# EAGLE design peripheral2 (EAGLE 7.6.0)
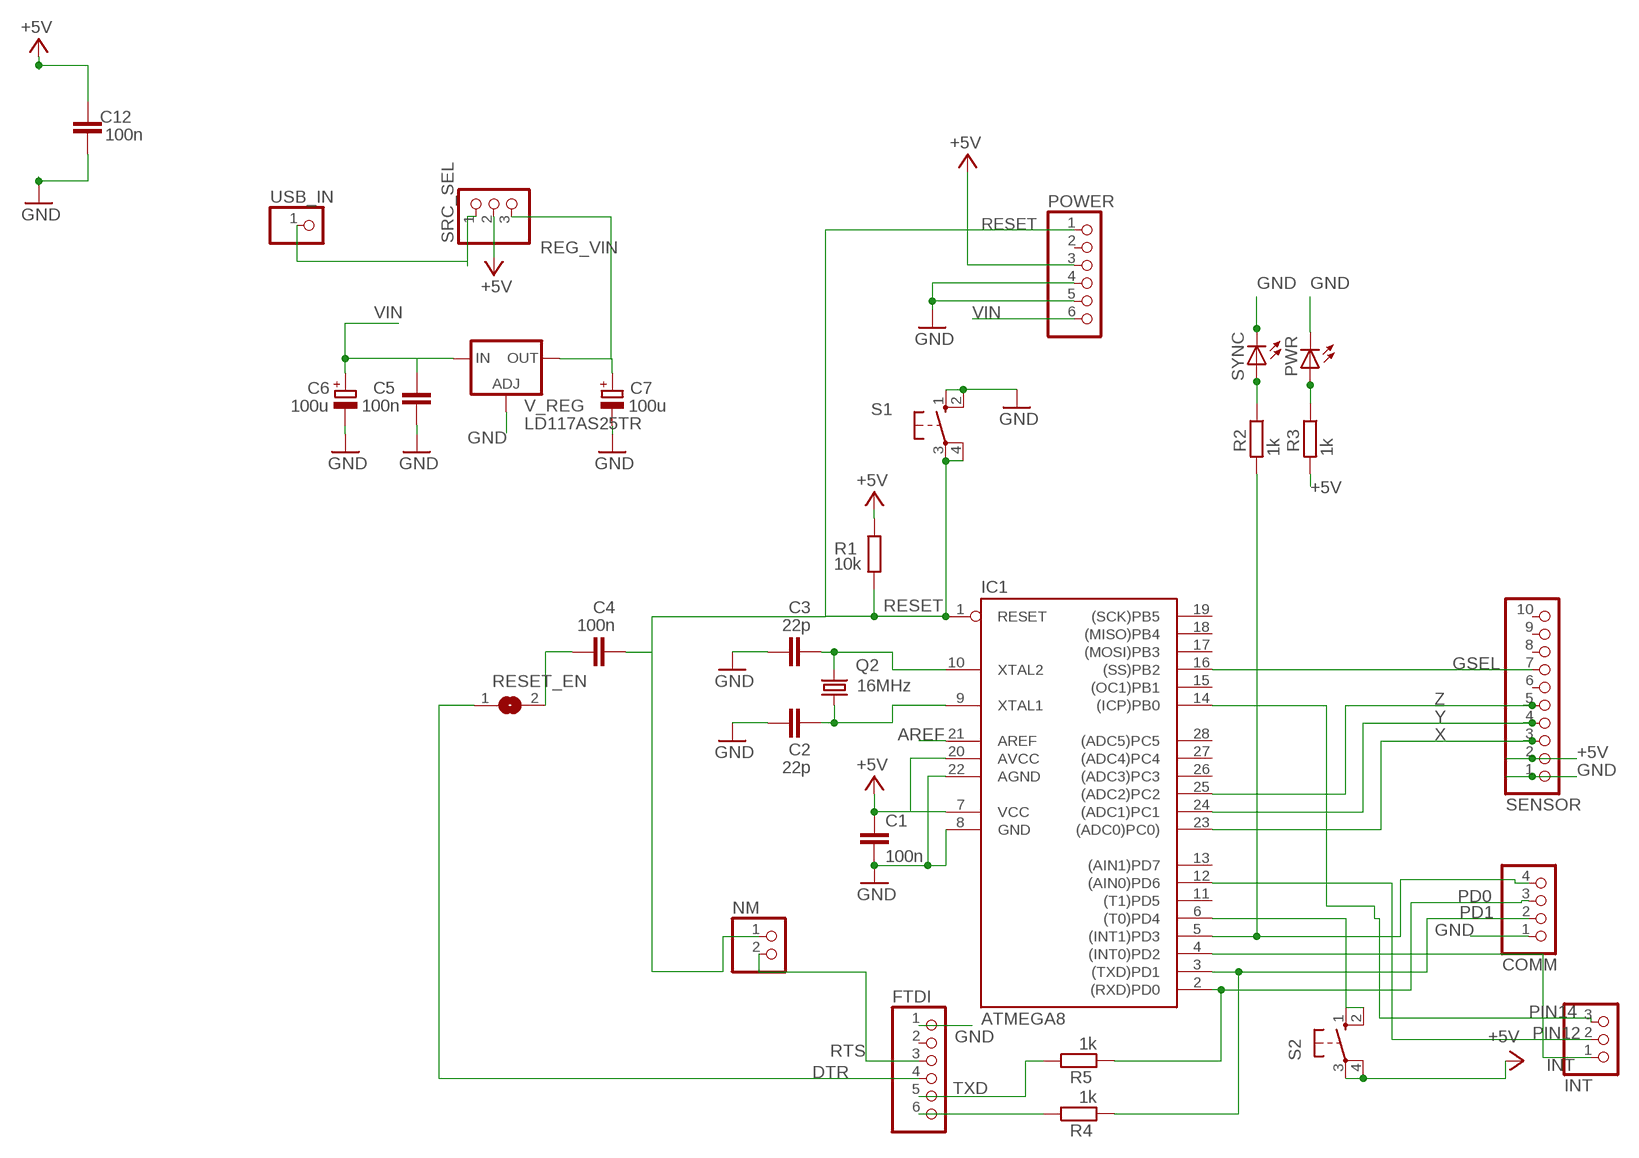
[diagram p0: schematic, sheet 1]

## Parts
C1  100n  C-EUC1206  [C1206]
C2  22p  C-EUC1206  [C1206]
C3  22p  C-EUC1206  [C1206]
C4  100n  C-EUC1206  [C1206]
C5  100n  C-EUC1206  [C1206]
C6  100u  CPOL-EUD  [PANASONIC_D]
C7  100u  CPOL-EUD  [PANASONIC_D]
C12  100n  C-EUC1206  [C1206]
COMM  PINHD-1X4  [1X04]
FTDI  PINHD-1X6  [1X06]
IC1  ATMEGA8  AT90S4433P  [DIL28-3]
INT  PINHD-1X3  [1X03]
NM  PINHD-1X2  [1X02]
POWER  PINHD-1X6  [1X06]
PWR  LEDCHIPLED_1206  [CHIPLED_1206]
Q2  16MHz  CRYTALHC49S  [HC49/S]
R1  10k  R-EU_R1206  [R1206]
R2  1k  R-EU_R1206  [R1206]
R3  1k  R-EU_R1206  [R1206]
R4  1k  R-EU_R1206  [R1206]
R5  1k  R-EU_R1206  [R1206]
RESET_EN  SJ  [SJ]
S1  10-XX  [B3F-10XX]
S2  10-XX  [B3F-10XX]
SENSOR  PINHD-1X10  [1X10]
SRC_SEL  PINHD-1X3  [1X03]
SYNC  LEDCHIPLED_1206  [CHIPLED_1206]
USB_IN  PINHD-1X1  [1X01]
V_REG  LD117AS25TR  [SOT223]

## Nets
+5V [usbvcc]: C1.1 C12.2 IC1.7(VCC) IC1.20(AVCC) POWER.3 R1.2 R3.2 S2.3(P) S2.4(P1) SENSOR.2 SRC_SEL.2
A3: COMM.4 IC1.5((INT1)PD3) R2.2
AREF [aref]: IC1.21(AREF)
DTR: FTDI.4 RESET_EN.1
GND [gnd]: C1.2 C2.1 C3.1 C5.1 C6.- C7.- C12.1 COMM.1 FTDI.1 IC1.8(GND) IC1.22(AGND) POWER.4 POWER.5 PWR.C S1.1(S) S1.2(S1) SENSOR.1 SYNC.C V_REG.1(ADJ)
GSEL: IC1.16((SS)PB2) SENSOR.7
INT: IC1.4((INT0)PD2) INT.1
N$1: R2.1 SYNC.A
N$2: PWR.A R3.1
N$5: FTDI.6 R4.1
N$6: C2.2 IC1.9(XTAL1) Q2.1
N$7: C3.2 IC1.10(XTAL2) Q2.2
N$10: IC1.6((T0)PD4) S2.1(S) S2.2(S1)
N$11: C4.1 RESET_EN.2
PD0: COMM.3 IC1.2((RXD)PD0) R5.2
PD1: COMM.2 IC1.3((TXD)PD1) R4.2
PIN12: IC1.12((AIN0)PD6) INT.2
PIN14: IC1.14((ICP)PB0) INT.3
REG_VIN [usbvcc]: C7.+ SRC_SEL.3 V_REG.4(OUT)
RESET: C4.2 IC1.1(RESET) NM.1 POWER.1 R1.1 S1.3(P) S1.4(P1)
RTS: FTDI.3 NM.2
TXD: FTDI.5 R5.1
USB_VCC: SRC_SEL.1 USB_IN.1
VIN [power]: C5.2 C6.+ POWER.6 V_REG.3(IN)
X: IC1.23((ADC0)PC0)) SENSOR.3
Y: IC1.24((ADC1)PC1) SENSOR.4
Z: IC1.25((ADC2)PC2) SENSOR.5
Unconnected: FTDI.2 IC1.11((T1)PD5) IC1.13((AIN1)PD7) IC1.15((OC1)PB1) IC1.17((MOSI)PB3) IC1.18((MISO)PB4) IC1.19((SCK)PB5) IC1.26((ADC3)PC3) IC1.27((ADC4)PC4) IC1.28((ADC5)PC5) POWER.2 SENSOR.6 SENSOR.8 SENSOR.9 SENSOR.10

## Library data of the parts
C1-C5 C12 = rcl:C-EU: CAPACITOR, European symbol
C6 C7 = rcl:CPOL-EU: POLARIZED CAPACITOR, European symbol
COMM = pinhead:PINHD-1X4: PIN HEADER
FTDI POWER = pinhead:PINHD-1X6: PIN HEADER
IC1 = atmel:AT90S4433: MICROCONTROLLER 4 Kbytes FLASH 128 bytes SRAM 256 bytes EEPROM UART 6-channel 10 bit ADC
INT SRC_SEL = pinhead:PINHD-1X3: PIN HEADER
NM = pinhead:PINHD-1X2: PIN HEADER
PWR SYNC = led:LED: LED OSRAM: - CHIPLED LG R971, LG N971, LY N971, LG Q971, LY Q971, LO R971, LY R971 LH N974, LH R974 LS Q976, LO Q976, LY Q976 LO Q996 - Hyper CHIPLED LW Q18S LB Q993, LB Q99A, LB R99A - SideLED LS A670, LO A670, LY A670, LG A670, LP A670 LB A673, LV A673, LT A673, LW A673 LH A674 LY A675 LS A676, LA A676, LO A676, LY A676, LW A676 LS A679, LY A679, LG A679 - Hyper Micro SIDELED® LS Y876, LA Y876, LO Y876, LY Y876 LT Y87S - SmartLED LW L88C, LW L88S LB L89C, LB L89S, LG L890 LS L89K, LO L89K, LY L89K LS L896, LA L896, LO L896, LY L896 - TOPLED LS T670, LO T670, LY T670, LG T670, LP T670 LSG T670, LSP T670, LSY T670, LOP T670, LYG T670 LG T671, LOG T671, LSG T671 LB T673, LV T673, LT T673, LW T673 LH T674 LS T676, LA T676, LO T676, LY T676, LB T676, LH T676, LSB T676, LW T676 LB T67C, LV T67C, LT T67C, LS T67K, LO T67K, LY T67K, LW E67C LS E67B, LA E67B, LO E67B, LY E67B, LB E67C, LV E67C, LT E67C LW T67C LS T679, LY T679, LG T679 LS T770, LO T770, LY T770, LG T770, LP T770 LB T773, LV T773, LT T773, LW T773 LH T774 LS E675, LA E675, LY E675, LS T675 LS T776, LA T776, LO T776, LY T776, LB T776 LHGB T686 LT T68C, LB T68C - Hyper Mini TOPLED® LB M676 - Mini TOPLED Santana® LG M470 LS M47K, LO M47K, LY M47K Source: http://www.osram.convergy.de LUXEON: - LUMILED® LXK2-PW12-R00, LXK2-PW12-S00, LXK2-PW14-U00, LXK2-PW14-V00 LXK2-PM12-R00, LXK2-PM12-S00, LXK2-PM14-U00 LXK2-PE12-Q00, LXK2-PE12-R00, LXK2-PE12-S00, LXK2-PE14-T00, LXK2-PE14-U00 LXK2-PB12-K00, LXK2-PB12-L00, LXK2-PB12-M00, LXK2-PB14-N00, LXK2-PB14-P00, LXK2-PB14-Q00 LXK2-PR12-L00, LXK2-PR12-M00, LXK2-PR14-Q00, LXK2-PR14-R00 LXK2-PD12-Q00, LXK2-PD12-R00, LXK2-PD12-S00 LXK2-PH12-R00, LXK2-PH12-S00 LXK2-PL12-P00, LXK2-PL12-Q00, LXK2-PL12-R00 Source: www.luxeon.com KINGBRIGHT: KA-3528ASYC Source: www.kingbright.com
Q2 = crystal:CRYTAL: CRYSTAL
R1-R5 = rcl:R-EU_: RESISTOR, European symbol
RESET_EN = jumper:SJ: SMD solder JUMPER
S1 S2 = switch-omron:10-XX: OMRON SWITCH; MPN: B3F-1000; OC_FARNELL: 176432; OC_NEWARK: 36M3542
SENSOR = pinhead:PINHD-1X10: PIN HEADER
USB_IN = pinhead:PINHD-1X1: PIN HEADER
V_REG = v-reg:LD117A?*: Low drop fixed and adjustable positive voltage regulators 1 A Source: http://www.st.com/stonline/products/literature/ds/7194/ld1117axx.pdf

## Net classes
0 default: width 0.254 mm, drill 0.305 mm, clearance 0.152 mm
1 power: width 0.61 mm, drill 0.508 mm, clearance 0.152 mm
2 gnd: width 0.305 mm, drill 0.508 mm, clearance 0.152 mm
3 usbvcc: width 0.508 mm, drill 0.508 mm, clearance 0.152 mm
4 aref: width 0.406 mm

## Board
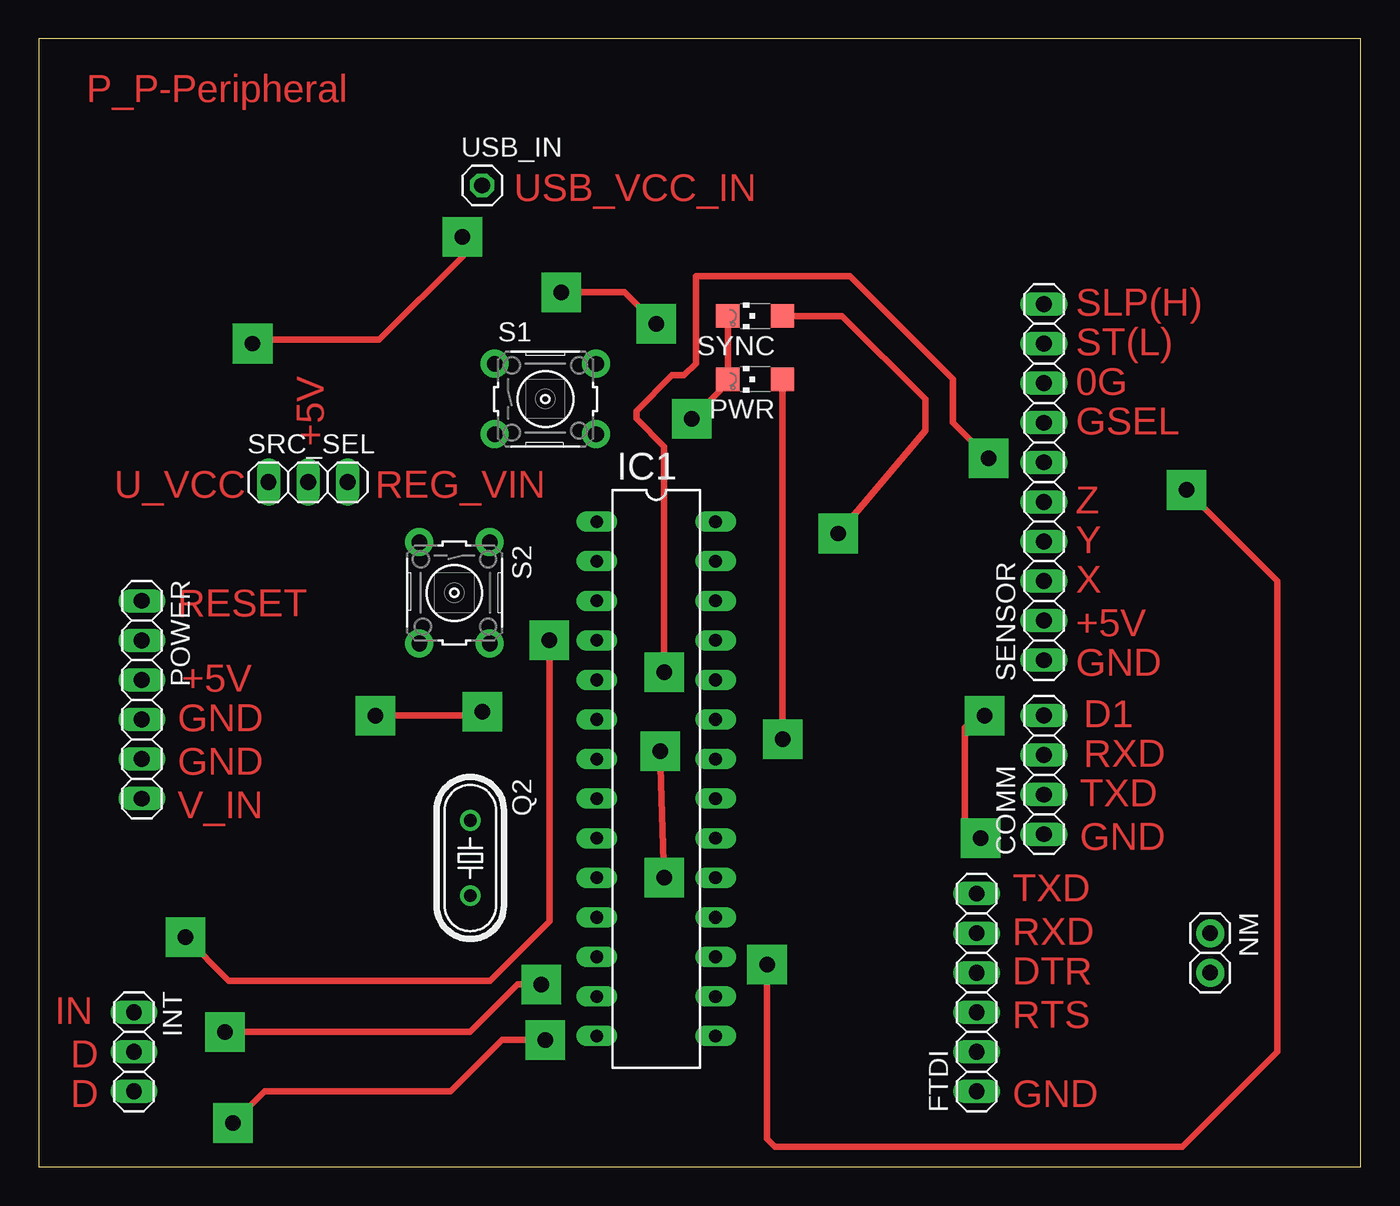
[diagram p1: board, top side]
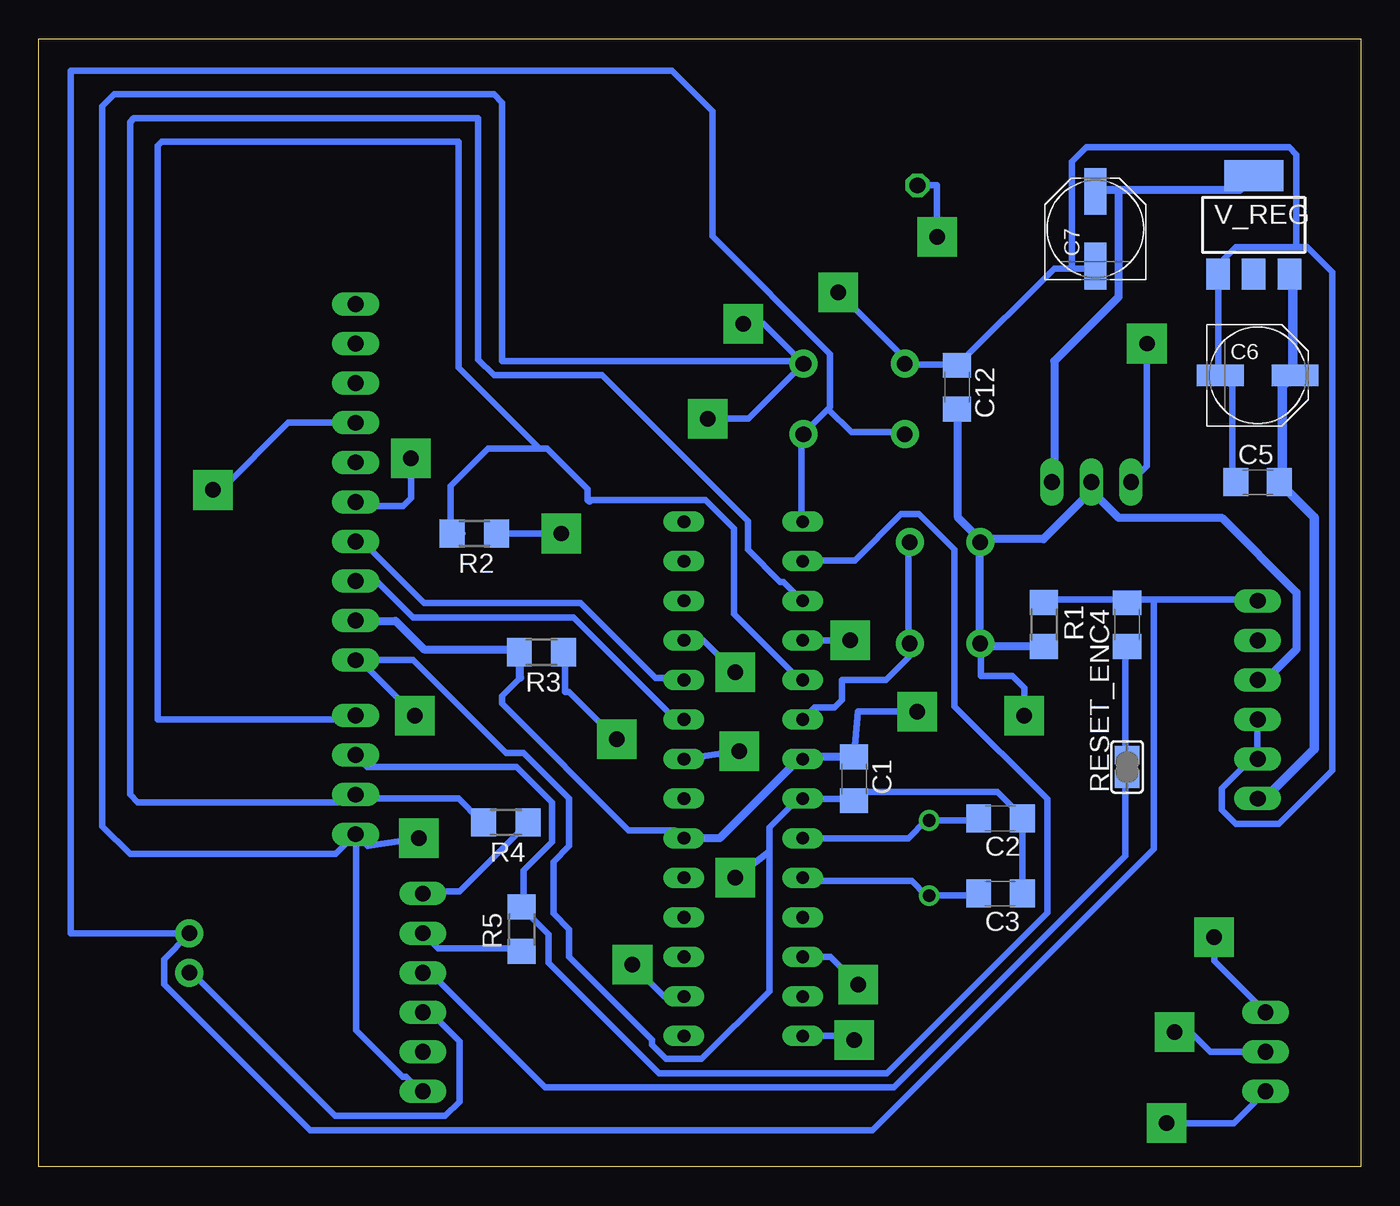
[diagram p2: board, bottom side, seen from below]

Size 84.84 x 72.39 mm. Coordinates in mm from the lower left corner, seen from the top.
Outline: 0,0 84.84,0 84.84,72.39 0,72.39 0,0
Copper layers (1*16): Top 0.035mm / dielectric 1.5mm / Bottom 0.035mm
Design rules "default *": minimum track width 16mil, minimum drill 24mil, track to track 20mil, track to pad 20mil, pad to pad 20mil, via to via 20mil, smd to smd 20mil, copper to edge 40mil, drill to drill 8mil, minimum pad ring 10mil, minimum via ring 8mil, stop-mask expansion 4mil, vias tented up to drill 0mil, thermal gap 10mil

### Footprints (pad centres in the part's own frame; a part is rotated, then mirrored left to right if it is on the bottom)
C1206 = smd 1.6 x 1.8: 1 -1.4,0; 2 1.4,0
PANASONIC_D = smd 3 x 1.4: + 2.4,0; - -2.4,0
1X04 = drill 1.016 long: 1 -3.81,0; 2 -1.27,0; 3 1.27,0; 4 3.81,0
1X06 = drill 1.016 long: 1 -6.35,0; 2 -3.81,0; 3 -1.27,0; 4 1.27,0; 5 3.81,0; 6 6.35,0
DIL28-3 = drill 0.813 long: 1 -16.51,-3.81; 2 -13.97,-3.81; 3 -11.43,-3.81; 4 -8.89,-3.81; 5 -6.35,-3.81; 6 -3.81,-3.81; 7 -1.27,-3.81; 8 1.27,-3.81; 9 3.81,-3.81; 10 6.35,-3.81; 11 8.89,-3.81; 12 11.43,-3.81; 13 13.97,-3.81; 14 16.51,-3.81; 15 16.51,3.81; 16 13.97,3.81; 17 11.43,3.81; 18 8.89,3.81; 19 6.35,3.81; 20 3.81,3.81; 21 1.27,3.81; 22 -1.27,3.81; 23 -3.81,3.81; 24 -6.35,3.81; 25 -8.89,3.81; 26 -11.43,3.81; 27 -13.97,3.81; 28 -16.51,3.81
1X03 = drill 1.016 long: 1 -2.54,0; 2 0,0; 3 2.54,0
1X02 = drill 1 pad 1.8: 1 -1.27,0; 2 1.27,0
CHIPLED_1206 = smd 1.5 x 1.5: A 0,-1.75; C 0,1.75
HC49/S = drill 0.813: 1 -2.413,0; 2 2.413,0
R1206 = smd 1.6 x 1.803: 1 -1.422,0; 2 1.422,0
SJ = smd 1.168 x 1.6: 1 -0.762,0; 2 0.762,0
B3F-10XX = drill 1 pad 1.8: 1 -3.251,2.261; 2 3.251,2.261; 3 -3.251,-2.261; 4 3.251,-2.261
1X10 = drill 1.016 long: 1 -11.43,0; 2 -8.89,0; 3 -6.35,0; 4 -3.81,0; 5 -1.27,0; 6 1.27,0; 7 3.81,0; 8 6.35,0; 9 8.89,0; 10 11.43,0
1X01 = drill 1.016 octagon: 1 0,0
SOT223 = smd 1.5 x 2: 1 -2.3,-3.15; 2 0,-3.15; 3 2.3,-3.15 | smd 3.8 x 2: 4 0,3.15

### Placement (x,y rotation side)
C1  32.51,24.89 270 bottom
C2  23.11,22.35 180 bottom
C3  23.11,17.53 180 bottom
C4  14.99,34.8 90 bottom
C5  6.6,43.94 0 bottom
C6  6.6,50.8 0 bottom
C7  17.02,60.2 90 bottom
C12  25.91,50.04 270 bottom
COMM  64.52,25.15 90 top
FTDI  60.2,11.18 90 top
IC1  39.62,24.89 270 top
INT  6.1,7.37 270 top
NM  75.18,13.72 270 top
POWER  6.6,29.97 270 top
PWR  45.97,50.55 90 top
Q2  27.69,19.81 270 top
R1  20.32,34.8 270 bottom
R2  56.9,40.64 180 bottom
R3  52.58,33.02 180 bottom
R4  54.86,22.1 180 bottom
R5  53.85,15.24 90 bottom
RESET_EN  14.99,25.65 90 bottom
S1  32.51,49.28 0 top
S2  26.67,36.83 270 top
SENSOR  64.52,43.94 90 top
SRC_SEL  17.27,43.94 0 top
SYNC  45.97,54.61 90 top
USB_IN  28.45,62.99 0 top
V_REG  6.86,60.45 0 bottom

### Tracks (layer width: path | path; a pad name or v marks a point on that pad's centre or on a via)
+5V  (via drill 0.99 pad 2.54)
  Top 0.406: v21.59,28.96 28.19,28.96 v28.45,29.21
  Bottom 0.406: v21.59,28.96 21.59,30.73 22.35,31.5 24.38,31.5 24.38,33.55 S2.4 | 43.66,21.08 arc-90 44.17,21.59 46.99,21.59 55.12,29.72 55.12,30.2 53.95,31.37 | v28.45,29.21 32.26,29.21 C1.1 32.26,26.55
  Bottom 0.508: R1.2 20.34,33.43 24.23,33.43 S2.4 24.46,33.66 24.46,39.83 S2.3 | C12.2 25.83,48.51 25.83,41.66 24.46,40.28 S2.3 | POWER.3 6.4,31.37 5.94,31.37 4.12,33.2 4.12,36.86 8.91,41.66 15.54,41.66 17.14,43.26 17.14,43.94 SRC_SEL.2 17.37,43.26 20.34,40.28 24.23,40.28 S2.3 | SENSOR.2 64.47,35.03 61.95,35.03 60.12,33.2 54.18,33.2 R3.2 53.95,32.97 53.95,31.37 | C1.1 32.69,26.34 35.66,26.34 IC1.7 35.89,26.34 41.15,21.08 IC1.20 43.66,21.08
A3
  Bottom 0.406: IC1.5 35.89,31.14 40.23,35.48 40.23,40.97 42.06,42.8 49.38,42.8 49.49,42.69 49.61,42.8 49.61,43.48 52.21,46.09 52.69,46.09 | 57.66,40.64 R2.2 58.42,40.74 58.42,43.69 56.02,46.09 52.69,46.09 | 52.69,46.09 57.91,51.31 57.91,65.79 76.96,65.79 77.22,65.53 77.22,28.7 64.77,28.7 COMM.4
DTR
  Bottom 0.406: RESET_EN.1 15.09,24.74 15.09,19.94 29.95,5.08 52.35,5.08 59.66,12.39 60.12,12.39 FTDI.4
GND  (via drill 0.99 pad 2.54)
  Top 0.406: SYNC.C PWR.C 44.22,50.32 v41.91,48.01 | v33.53,56.13 37.59,56.13 v39.62,54.1 | v60.71,28.96 60.2,28.96 59.44,28.19 59.44,21.34 v60.45,21.08 | v40.13,18.54 v39.88,26.67
  Bottom 0.406: FTDI.1 60.35,4.85 61.27,5.77 61.49,5.77 64.47,8.74 64.47,21.31 COMM.1 | 65.15,21.54 64.69,21.54 COMM.1 | S1.2 35.89,51.71 55.09,51.71 55.09,68.3 55.63,68.83 80.01,68.83 80.77,68.07 80.77,21.84 78.99,20.07 65.79,20.07 COMM.1 | C3.1 21.72,17.65 21.72,22.22 C2.1 21.72,22.45 23.32,24.05 32,24.05 32.46,23.6 C1.2 32.69,23.6 35.66,23.6 IC1.8 35.89,23.82 37.95,21.77 37.95,20.22 | 37.95,20.22 37.95,11.25 42.29,6.91 44.58,6.91 45.49,7.82 45.49,8.15 50.8,13.46 50.8,15.24 51.82,16.26 51.82,19.56 50.8,20.57 50.8,23.65 53.72,26.57 54.86,26.57 60.81,32.51 SENSOR.1 64.26,32.51 v60.71,28.96 | 18.52,57.66 19.66,57.66 25.83,51.49 C12.1 26.06,51.49 29.26,51.49 S1.1 29.26,51.87 v33.53,56.13 | 18.52,57.66 17.14,57.66 C7.- | POWER.4 6.63,28.63 6.63,26.34 POWER.5 6.63,26.11 7.09,26.11 8.91,24.28 8.91,22.91 8,22 5.26,22 1.83,25.43 1.83,57.43 3.43,59.03 4.12,59.03 | C5.1 8.23,43.94 8.23,50.11 8.91,50.8 C6.- 9.14,50.8 9.14,57.2 V_REG.1 9.14,57.43 9.14,57.89 8,59.03 4.12,59.03 | 18.52,57.66 18.52,64.52 17.6,65.43 4.57,65.43 4.12,64.97 4.12,59.03 | v41.91,48.01 39.29,48.01 S1.2 | v39.62,54.1 38.33,54.1 S1.2 | v60.45,21.08 63.75,20.57 COMM.1 | 37.95,20.22 v40.13,18.54 | v39.88,26.67 IC1.22
GSEL  (via drill 0.99 pad 2.54)
  Top 0.406: v46.74,12.95 46.74,1.78 47.24,1.27 73.41,1.27 79.5,7.37 79.5,37.59 v73.66,43.43
  Bottom 0.406: IC1.16 44.7,10.92 v46.74,12.95 | v73.66,43.43 73.15,43.43 68.83,47.75 SENSOR.7
INT  (via drill 0.99 pad 2.54)
  Top 0.406: v32.77,33.78 32.77,15.75 28.96,11.94 12.19,11.94 v9.4,14.73
  Bottom 0.406: IC1.4 v32.77,33.78 | v9.4,14.73 9.4,13.21 INT.1
N$1  (via drill 0.99 pad 2.54)
  Top 0.406: SYNC.A 51.56,54.61 56.9,49.28 56.9,47.24 v51.31,40.64
  Bottom 0.406: v51.31,40.64 R2.1
N$2  (via drill 0.99 pad 2.54)
  Top 0.406: PWR.A 47.72,27.46 v47.75,27.43
  Bottom 0.406: R3.1 51.05,32.92 51.05,30.48 50.8,30.48 v47.75,27.43
N$5
  Bottom 0.406: R4.1 53.49,22 57.84,17.65 60.12,17.65 FTDI.6
N$6
  Bottom 0.406: C2.2 24.69,22.22 Q2.1 27.89,22.22 29.03,21.08 IC1.9
N$7
  Bottom 0.406: C3.2 24.69,17.42 27.66,17.42 Q2.2 27.89,17.42 28.8,18.34 35.66,18.34 IC1.10
N$10
  Bottom 0.406: 29.03,33.66 29.03,40.06 S2.1 | 29.03,33.66 S2.2 | 29.03,33.66 29.03,32.69 30.48,31.24 33.27,31.24 33.27,29.97 33.78,29.46 35.05,29.46 IC1.6
N$11
  Bottom 0.406: RESET_EN.2 15.09,26.57 15.09,33.2 C4.1
PD0
  Bottom 0.406: COMM.3 64.47,26.34 63.78,25.65 54.18,25.65 51.89,23.37 51.89,20.85 53.72,19.02 53.72,16.74 R5.2 53.72,16.51 52.12,14.91 52.12,13.08 45.03,5.99 30.4,5.99 20.12,16.28 20.12,23.6 26.06,29.54 26.06,39.6 28.35,41.89 29.49,41.89 32.46,38.91 35.66,38.91 IC1.2
PD1
  Bottom 0.406: 64.01,23.82 64.47,23.82 COMM.2 | R4.2 56.46,22.22 56.52,22.22 57.91,23.62 64.26,23.62 COMM.2 | IC1.3 37.03,37.54 37.26,37.54 39.32,39.6 39.32,41.43 48.69,50.8 55.63,50.8 56.64,51.82 56.64,67.31 78.74,67.31 78.99,67.06 78.99,23.88 78.49,23.37 65.02,23.37 COMM.2 | 65.15,24.05 64.69,24.05 COMM.2
PIN12  (via drill 0.99 pad 2.54)
  Top 0.406: v32.26,11.68 30.73,11.68 27.69,8.64 v11.94,8.64
  Bottom 0.406: IC1.12 34.04,13.46 v32.26,11.68 | v11.94,8.64 10.92,8.64 9.65,7.37 INT.2
PIN14  (via drill 0.99 pad 2.54)
  Top 0.406: v32.51,8.13 29.72,8.13 26.42,4.83 14.48,4.83 v12.45,2.79
  Bottom 0.406: IC1.14 32.77,8.38 v32.51,8.13 | v12.45,2.79 8.13,2.79 INT.3
REG_VIN
  Bottom 0.508: 15.54,62.69 7.77,62.69 V_REG.4 | 15.54,62.69 16.92,62.69 C7.+ | V_REG.4 | 15.54,62.69 15.54,55.83 19.66,51.71 19.66,43.94 SRC_SEL.3
RESET
  Bottom 0.406: R1.1 20.12,36.4 15.09,36.4 C4.2 14.86,36.4 13.26,36.4 | 13.26,36.4 6.63,36.4 POWER.1 | IC1.1 35.89,41.43 35.89,46.91 S1.4 35.66,47.14 34.18,48.63 | 34.18,48.63 34.06,48.74 34.06,52.17 41.6,59.72 41.6,67.77 44.2,70.36 82.8,70.36 82.8,14.99 NM.1 | 74.98,15.14 NM.1 | 34.18,48.63 32.69,47.14 29.26,47.14 S1.3 | 13.26,36.4 13.26,20.4 31.32,2.34 67.44,2.34 76.81,11.71 76.81,13.31 75.21,14.91 NM.1
RTS
  Bottom 0.406: FTDI.3 60.12,9.88 59.66,9.88 57.84,8.05 57.84,4.17 58.75,3.25 65.84,3.25 74.98,12.39 NM.2
TXD
  Bottom 0.406: FTDI.5 59.21,14 53.95,14 R5.1
USB_VCC  (via drill 0.99 pad 2.54)
  Top 0.406: v27.18,59.69 27.18,58.42 21.84,53.09 13.97,53.09 v13.72,52.83
  Bottom 0.406: USB_IN.1 27.18,62.99 v27.18,59.69 | v13.72,52.83 13.72,44.96 SRC_SEL.1
VIN
  Bottom 0.61: V_REG.3 4.34,57.2 4.34,51.03 C6.+ 4.34,50.8 5.03,50.11 5.03,43.94 C5.2 5.03,43.71 2.97,41.66 2.97,26.8 5.94,23.82 6.4,23.82 POWER.6
X
  Bottom 0.406: IC1.23 43.43,28.85 44.12,28.85 50.52,35.26 60.81,35.26 63.09,37.54 64.47,37.54 SENSOR.3
Y
  Bottom 0.406: IC1.24 43.43,31.37 45.26,31.37 50.06,36.17 60.12,36.17 64.01,40.06 64.47,40.06 SENSOR.4
Z  (via drill 0.99 pad 2.54)
  Top 0.406: v40.13,31.75 40.13,46.23 38.35,48.01 38.35,48.51 40.64,50.8 41.4,50.8 42.16,51.56 42.16,57.15 52.07,57.15 58.67,50.55 58.67,47.75 v60.96,45.47
  Bottom 0.406: IC1.25 42.16,33.78 v40.13,31.75 | v60.96,45.47 60.96,42.93 61.47,42.42 64.26,42.42 SENSOR.5

### Text on the board
Top: P_P-Peripheral | USB_VCC_IN | SLP(H) | ST(L) | 0G | +5V | GSEL | U_VCC | REG_VIN | Z | Y | X | RESET | +5V | GND | +5V | D1 | GND | GND | RXD | TXD | V_IN | GND | TXD | RXD | DTR | IN | RTS | D | D | GND